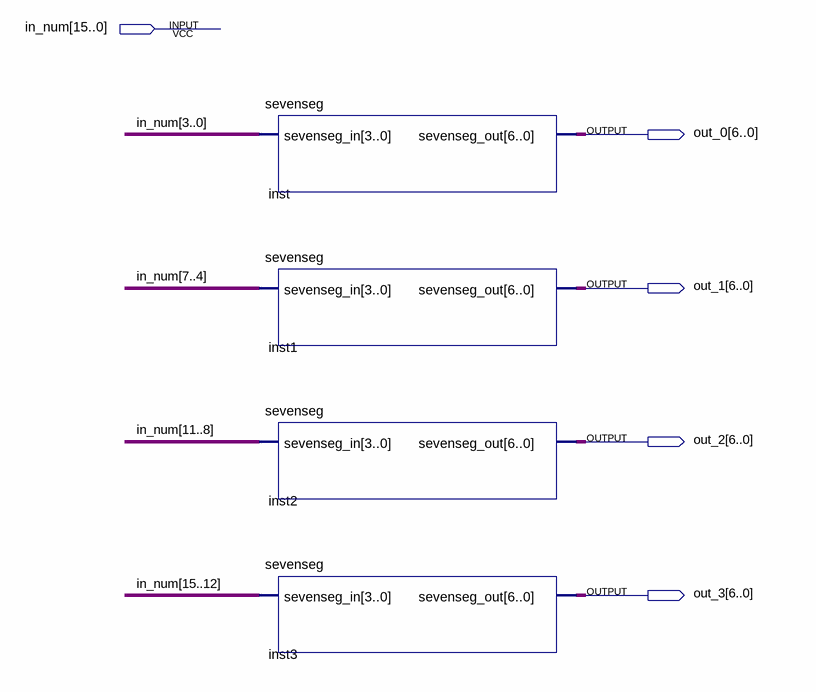
[diagram p0: schematic sheet]
// Quartus schematic fdss.bdf as structural Verilog: 4 symbols, 5 pins
module fdss (
  input  [15:0] in_num,
  output [6:0] out_0,
  output [6:0] out_1,
  output [6:0] out_2,
  output [6:0] out_3
);

  sevenseg inst (.sevenseg_in(in_num[3:0]), .sevenseg_out(out_0));
  sevenseg inst1 (.sevenseg_in(in_num[7:4]), .sevenseg_out(out_1));
  sevenseg inst2 (.sevenseg_in(in_num[11:8]), .sevenseg_out(out_2));
  sevenseg inst3 (.sevenseg_in(in_num[15:12]), .sevenseg_out(out_3));
endmodule
